# Altium schematic sheet MODULES.SchDoc
size 420 x 297 mm; SheetNumber: 3; SheetTotal: 3
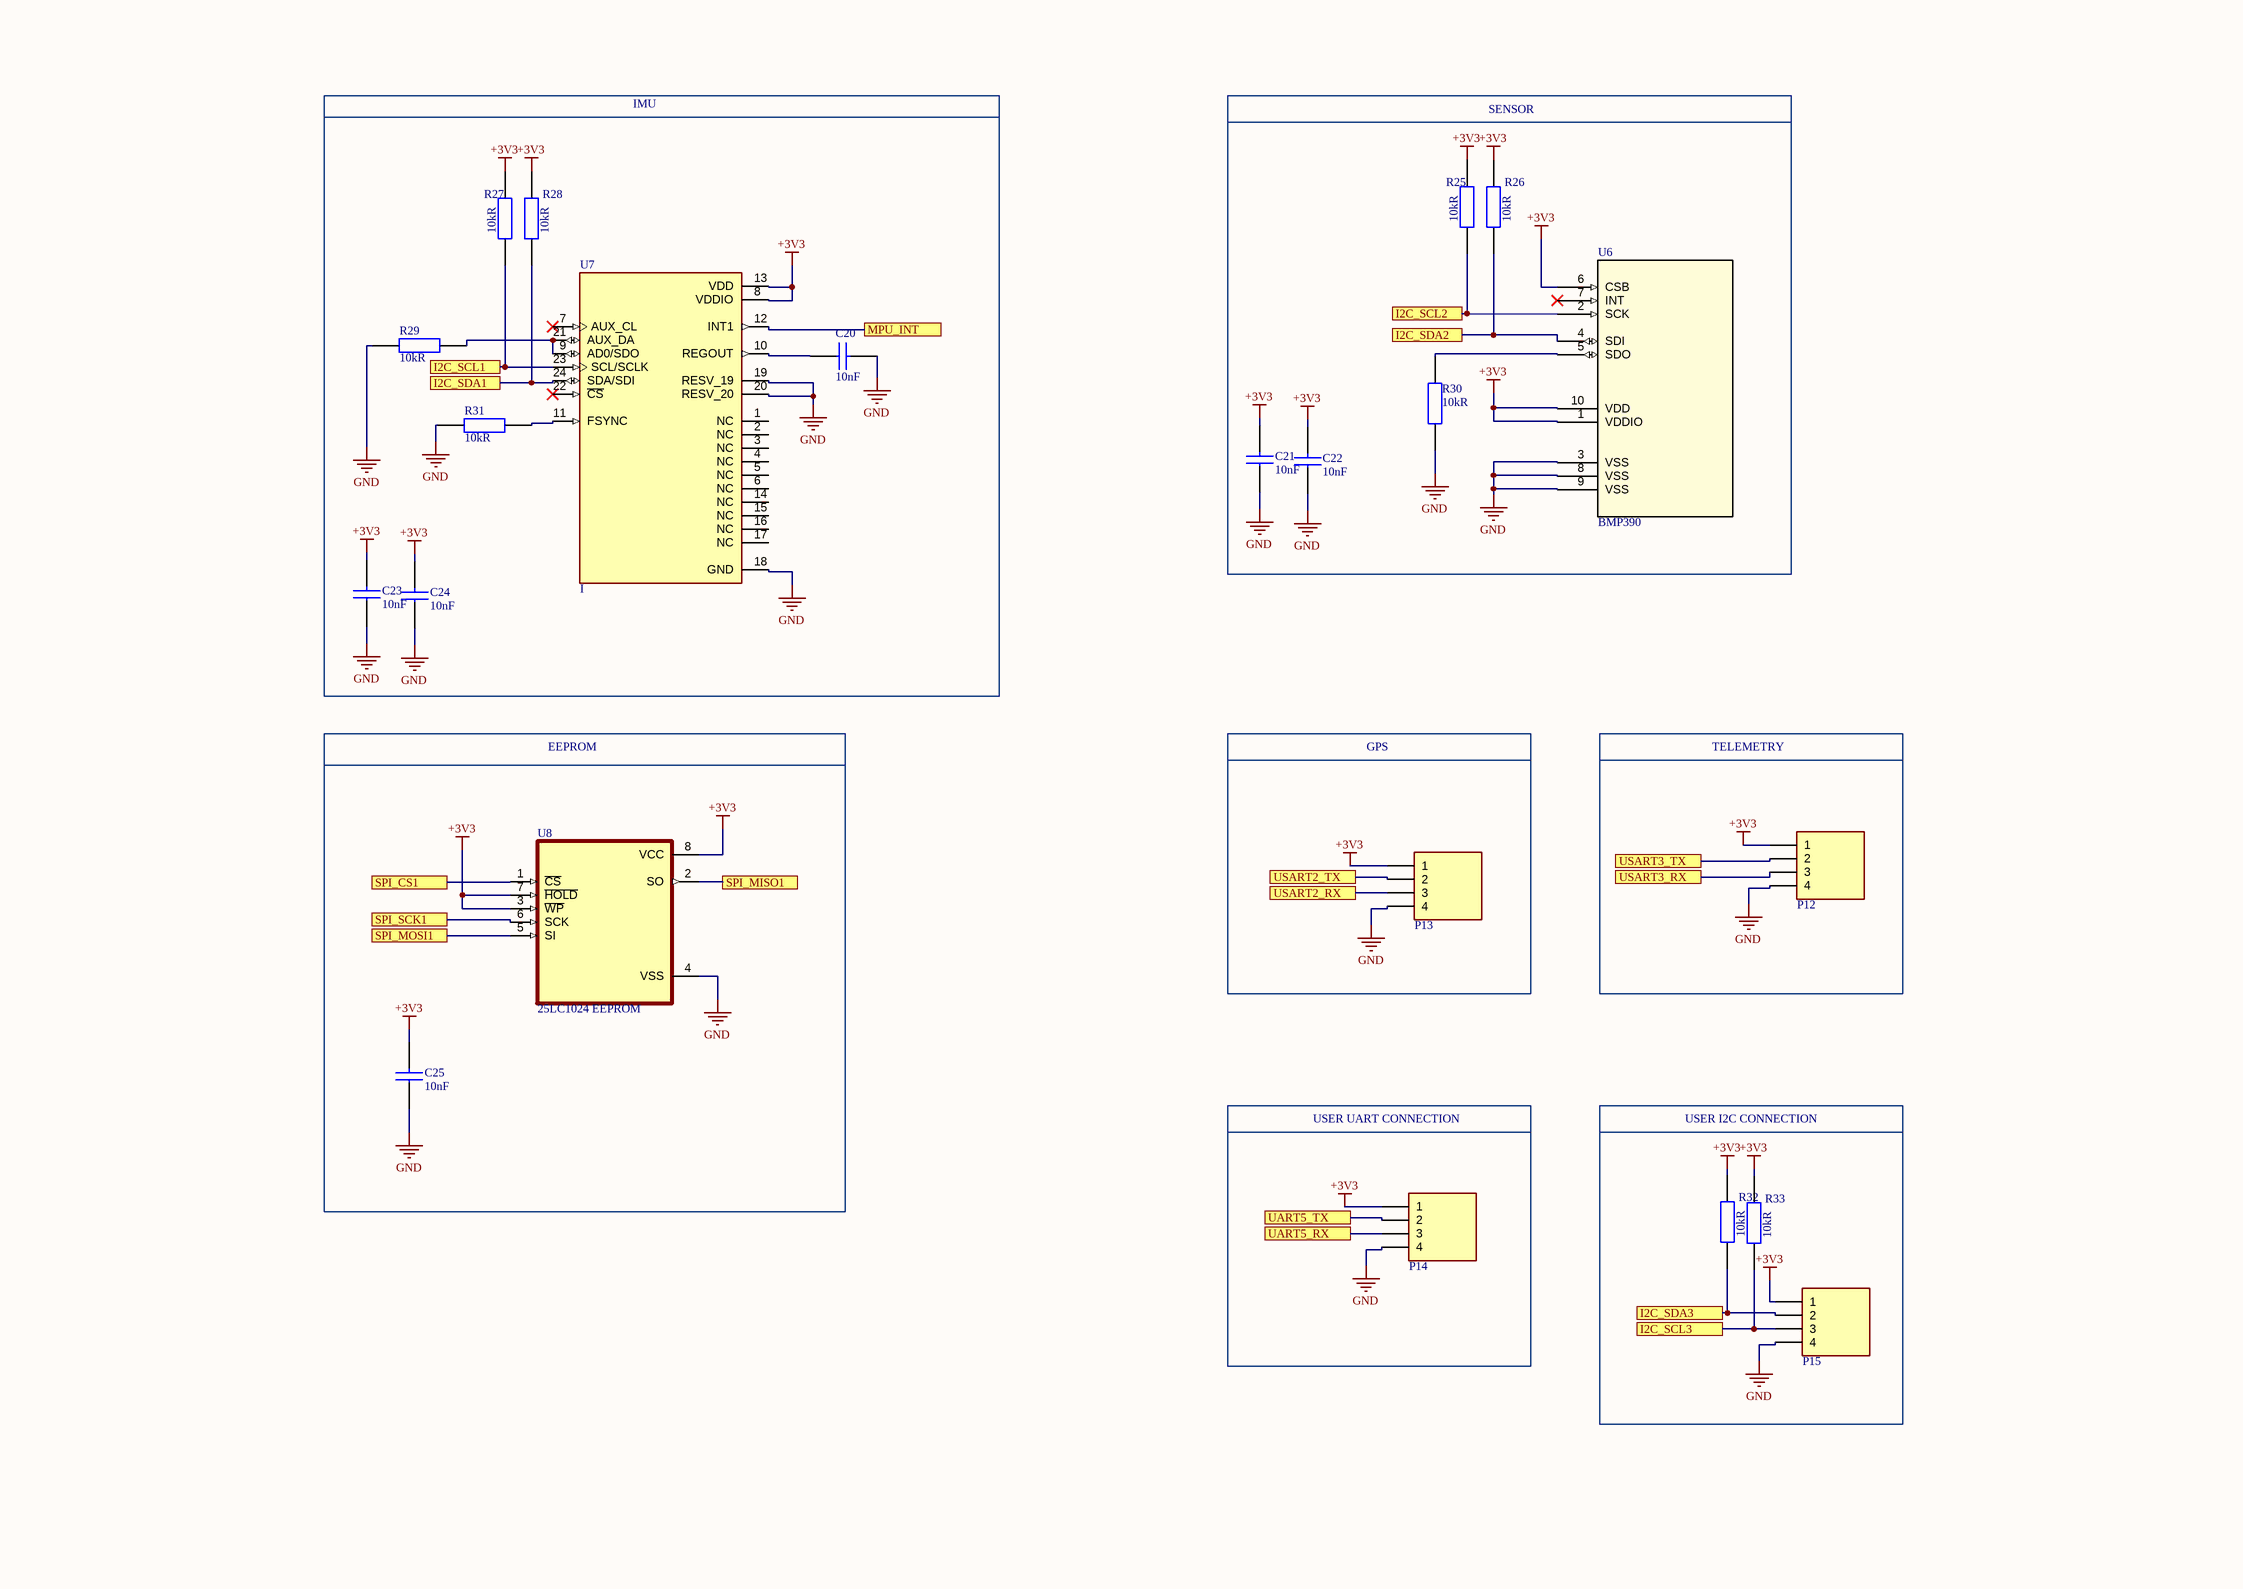
[diagram p0: MODULES.SchDoc]

## Parts
C20  Capacitance: 10nF  [CAP_0603]  (hidden comment: 0603B103K160CT)
C21  Capacitance: 10nF  [CAP_0603]  (hidden comment: 0603B103K160CT)
C22  Capacitance: 10nF  [CAP_0603]  (hidden comment: 0603B103K160CT)
C23  Capacitance: 10nF  [CAP_0603]  (hidden comment: 0603B103K160CT)
C24  Capacitance: 10nF  [CAP_0603]  (hidden comment: 0603B103K160CT)
C25  Capacitance: 10nF  [CAP_0603]  (hidden comment: 0603B103K160CT)
P12  HEADER 4 PIN  [S4B-XH-A]  (value not drawn)
P13  HEADER 4 PIN  [S4B-XH-A]  (value not drawn)
P14  HEADER 4 PIN  [S4B-XH-A]  (value not drawn)
P15  HEADER 4 PIN  [S4B-XH-A]  (value not drawn)
R25  Resistance: 10kR  [RES_0603]  (hidden comment: RC0603FR-0710KL)
R26  Resistance: 10kR  [RES_0603]  (hidden comment: RC0603FR-0710KL)
R27  Resistance: 10kR  [RES_0603]  (hidden comment: RC0603FR-0710KL)
R28  Resistance: 10kR  [RES_0603]  (hidden comment: RC0603FR-0710KL)
R29  Resistance: 10kR  [RES_0603]  (hidden comment: RC0603FR-0710KL)
R30  Resistance: 10kR  [RES_0603]  (hidden comment: RC0603FR-0710KL)
R31  Resistance: 10kR  [RES_0603]  (hidden comment: RC0603FR-0710KL)
R32  Resistance: 10kR  [RES_0603]  (hidden comment: RC0603FR-0710KL)
R33  Resistance: 10kR  [RES_0603]  (hidden comment: RC0603FR-0710KL)
U6  BMP390  [WFLGA-10]
U7  I  [TFQFN-24]
U8  25LC1024 EEPROM  [SOIJ8]

## Blocks framed on the sheet
IMU: C20 C23 C24 R27-R29 R31 U7
SENSOR: C21 C22 R25 R26 R30 U6
EEPROM: C25 U8
GPS: P13
TELEMETRY: P12
USER UART CONNECTION: P14
USER I2C CONNECTION: P15 R32 R33

## Ports
I2C_SCL1 (see MICROCONTROLLER[2B]), I2C_SCL2 (see MICROCONTROLLER[2B]), I2C_SCL3 (see MICROCONTROLLER[2B]), I2C_SDA1 (see MICROCONTROLLER[2B]), I2C_SDA2 (see MICROCONTROLLER[2B]), I2C_SDA3 (see MICROCONTROLLER[4B]), MPU_INT (see MICROCONTROLLER[4A]), SPI_CS1 (see MICROCONTROLLER[2A]), SPI_MISO1 (see MICROCONTROLLER[2B]), SPI_MOSI1 (see MICROCONTROLLER[2B]), SPI_SCK1 (see MICROCONTROLLER[2A]), UART5_RX (see MICROCONTROLLER[4B]), UART5_TX (see MICROCONTROLLER[4B]), USART2_RX (see MICROCONTROLLER[2A]), USART2_TX (see MICROCONTROLLER[2A]), USART3_RX (see MICROCONTROLLER[4B]), USART3_TX (see MICROCONTROLLER[4B])

## Nets
+3V3: C21.2 C22.2 C23.2 C24.2 C25.2 P12.1 P13.1 P14.1 P15.1 R25.2 R26.2 R27.2 R28.2 R32.2 R33.2 U6.1(VDDIO) U6.6(CSB) U6.10(VDD) U7.8(VDDIO) U7.13(VDD) U8.3(~{WP}) U8.7(~{HOLD}) U8.8(VCC)
GND: C20.2 C21.1 C22.1 C23.1 C24.1 C25.1 P12.4 P13.4 P14.4 P15.4 R29.1 R30.1 R31.1 U6.3(VSS) U6.8(VSS) U6.9(VSS) U7.18(GND) U7.19(RESV_19) U7.20(RESV_20) U8.4(VSS)
I2C_SCL1: R27.1 U7.23(SCL/SCLK) ; port I2C_SCL1
I2C_SCL2: R25.1 U6.2(SCK) ; port I2C_SCL2
I2C_SCL3: P15.3 R33.1 ; port I2C_SCL3
I2C_SDA1: R28.1 U7.24(SDA/SDI) ; port I2C_SDA1
I2C_SDA2: R26.1 U6.4(SDI) ; port I2C_SDA2
I2C_SDA3: P15.2 R32.1 ; port I2C_SDA3
MPU_INT: U7.12(INT1) ; port MPU_INT
SPI_CS1: U8.1(~{CS}) ; port SPI_CS1
SPI_MISO1: U8.2(SO) ; port SPI_MISO1
SPI_MOSI1: U8.5(SI) ; port SPI_MOSI1
SPI_SCK1: U8.6(SCK) ; port SPI_SCK1
UART5_RX: P14.3 ; port UART5_RX
UART5_TX: P14.2 ; port UART5_TX
USART2_RX: P13.3 ; port USART2_RX
USART2_TX: P13.2 ; port USART2_TX
USART3_RX: P12.3 ; port USART3_RX
USART3_TX: P12.2 ; port USART3_TX
NetC20_1: C20.1 U7.10(REGOUT)
NetR29_2: R29.2 U7.9(AD0/SDO) U7.21(AUX_DA)
NetR30_2: R30.2 U6.5(SDO)
NetR31_2: R31.2 U7.11(FSYNC)

Not connected (* = marked no-connect by the designer): U6 7(INT)*; U7 1(NC) 2(NC) 3(NC) 4(NC) 5(NC) 6(NC) 7(AUX_CL)* 14(NC) 15(NC) 16(NC) 17(NC) 22(~{CS})*

## Notes on the sheet
- THIS DOCUMENT AND THE DATA DISCLOSED HEREIN OR
- HEREWITH IS THE PROPERTY OF ALTIUM LIMITED AND MAY
- DWG NO:
- REVISION
- REV:
- DESCRIPTION
- DATE
- APPROVED
- BE FREELY DISTRIBUTED IN WHOLE. NO RIGHTS ARE
- RESERVED OR EXPRESS OR IMPLIED WARANTEE GIVEN.
- ENG:
- APPROVALS
- PROJECT
- DSN:
- CHK:
- REFERENCE DOCUMENTS
- PROJECT REVISION:
- TITLE
- DOCUMENT REVISION:
- DESIGN ITEM:
- BOM:
- FAB DWG:
- PCB DWG:
- ASSY DWG:
- SCALE:
- A3
- SIZE
- CAGE CODE
- FILE NAME
- DWG NO.
- SHEET
- OF
- REV

## Library data of the parts
C20-C25 = CAP CER 10nF 0603: CAP CER 10nF %10 0603; Manufacturer: Walsin Technologies; Designed by: BERK; Tolerance: 10%; Dielectric: X7R; Voltage Rating: 16V; Supplier 1: Digi-Key; Manufacturer Part Number: 0603B103K160CT; RoHS: Yes; Category: Ceramic Capacitors; Stock 1: 102474; Pricing 1: 1=0,10000, 10=0,03600, 50=0,01940, 100=0,01590, 500=0,01136, 1000=0,00892 (USD); Case/Package: 0603; Case Code (Metric): 1608; Case Code (Imperial): 0603; Min Operating Temperature: -55°C; Max Operating Temperature: 125°C; Packaging: Tape and Reel; Voltage Rating (DC): 16V; Length: 1.6mm; Depth: 0.8mm; REACH SVHC: Unknown; RoHS Compliant: Yes; ComponentLink1URL: http://www.farnell.com/datasheets/1958513.pdf?src-supplier=Farnell; ComponentLink1Description: http://www.farnell.com/datasheets/1958513.pdf?src-supplier=Farnell; ComponentLink2URL: http://components.arrow.com/part/dataview/0323_00656382?src-supplier=Arrow+Europe; ComponentLink2Description: http://components.arrow.com/part/dataview/0323_00656382?src-supplier=Arrow+Europe; ComponentLink3URL: http://www.farnell.com/datasheets/1958513.pdf?src-supplier=Element14; ComponentLink3Description: http://www.farnell.com/datasheets/1958513.pdf?src-supplier=Element14; ComponentLink4URL: http://www.passivecomponent.com/wp-content/uploads/2018/10/MLCC.pdf?src-supplier=Digi-Key; ComponentLink4Description: http://www.passivecomponent.com/wp-content/uploads/2018/10/MLCC.pdf?src-supplier=Digi-Key; Supplier Part Number 1: 1292-1384-1-ND
P12-P15 = HEADER 4 PIN: Header, Right Angle, 4Way; |Jst / Japan Solderless Terminals S4B-XH-A (LF)(SN); Manufacturer: JST; Connector Type: Male Pin; Contact Resistance: 20mΩ; Current Rating: 3A; Gender: Male; Insulation Resistance: 1GΩ; Max Voltage Rating (AC): 250V; Number of Contacts: 4; Pitch: 2.4892mm; Ratings: TUV; Wire/Cable Gauge: 22AWG; Supplier 1: Farnell; Manufacturer Part Number: S4B-XH-A(LF)(SN); RoHS: Compliant; Category: Headers and Wire Housings; Stock 1: 59807; Pricing 1: 100=0,172, 500=0,149, 1000=0,142, 2500=0,139 (EUR); China RoHS: Compliant; Contact Material: Brass; Contact Plating: Tin; Country of Origin: Japan; Depth: 11.5mm; Export Control Classification Number (ECCN) Code: EAR99; Height: 6.1mm; Housing Color: White; Housing Material: Polyamide; Harmonized Tariff Schedule (HTS) Code: 8536.69.40.40; Insulation Color: White; Introduction Date: 2005-10-20; Lead Free: Lead Free; Lead Pitch: 2.5mm; Length: 12.4mm; Lifecycle Status: Production; Max Current Rating: 3A; Max Operating Temperature: 85°C; Min Operating Temperature: -25°C; Mount: Through Hole; Number of Pins: 4; Number of Poles: 4; Number of Positions: 4; Number of Rows: 1; Orientation: Right Angle; REACH SVHC: No; Terminal Pitch: 2.5mm; Termination: Solder; Voltage Rating: 250V; Voltage Rating (AC): 250V; Weight: 28.349523g; Width: 11.5mm; ComponentLink1URL: https://datasheet.octopart.com:443/S4B-XH-A%28LF%29%28SN%29-JST-datasheet-12510042.pdf?src-supplier=Upverter; ComponentLink1Description: https://datasheet.octopart.com:443/S4B-XH-A%28LF%29%28SN%29-JST-datasheet-12510042.pdf?src-supplier=Upverter; ComponentLink2URL: https://datasheet.octopart.com:443/S4B-XH-A%28LF%29%28SN%29-JST-datasheet-8325564.pdf?src-supplier=Burklin+Elektronik; ComponentLink2Description: https://datasheet.octopart.com:443/S4B-XH-A%28LF%29%28SN%29-JST-datasheet-8325564.pdf?src-supplier=Burklin+Elektronik; ComponentLink3URL: https://datasheet.octopart.com:443/S4B-XH-A%28LF%29%28SN%29-JST-datasheet-138896056.pdf?src-supplier=IHS; ComponentLink3Description: https://datasheet.octopart.com:443/S4B-XH-A%28LF%29%28SN%29-JST-datasheet-138896056.pdf?src-supplier=IHS; ComponentLink4URL: https://datasheet.octopart.com:443/S4B-XH-A-%28LF%29%28SN%29-JST-datasheet-62336360.pdf?src-supplier=element14+APAC; ComponentLink4Description: https://datasheet.octopart.com:443/S4B-XH-A-%28LF%29%28SN%29-JST-datasheet-62336360.pdf?src-supplier=element14+APAC; ComponentLink5URL: https://datasheet.octopart.com:443/S4B-XH-A-%28LF%29%28SN%29-JST-datasheet-63094.pdf?src-supplier=element14+APAC; ComponentLink5Description: https://datasheet.octopart.com:443/S4B-XH-A-%28LF%29%28SN%29-JST-datasheet-63094.pdf?src-supplier=element14+APAC; ComponentLink6URL: https://datasheet.octopart.com:443/S4B-XH-A%28LF%29%28SN%29-JST-datasheet-140264791.pdf?src-supplier=LKR; ComponentLink6Description: https://datasheet.octopart.com:443/S4B-XH-A%28LF%29%28SN%29-JST-datasheet-140264791.pdf?src-supplier=LKR; Supplier Part Number 1: S4B-XH-A (LF)(SN)
R25-R33 = RES 10K OHM 0603: RES 10K %1 OHM 0603 SMD; Manufacturer: Yageo; Designed by: BERK; Tolerance: 1%; Temperature Coefficient: 100ppm/°C; Voltage Rating (DC): 50V; Power Rating: 100mW; Voltage Rating: 75V; Supplier 1: Digi-Key; Manufacturer Part Number: RC0603FR-0710KL; RoHS: Yes; Category: Chip SMD Resistors; Stock 1: 24140601; Pricing 1: 1=0,10000, 10=0,02300, 100=0,00930, 1000=0,00417, 2500=0,00362 (USD); Case/Package: 0603; Number of Pins: 2; Case Code (Imperial): 0603; Case Code (Metric): 1608; Weight: 7.1E-05oz; Size Code: 0603; Min Operating Temperature: -55°C; Max Operating Temperature: 155°C; Resistor Type: Thick Film; Packaging: Tape and Reel; Termination: SMD/SMT; Features: Moisture Resistant; Series: RC; Max Power Dissipation: 100mW; Number of Terminations: 2; Resistance Tolerance: 1%; Construction: Rectangular; Length: 1.6mm; Width: 0.8mm; Height: 0.45mm; Depth: 0.8mm; Lead Pitch: 0.3mm; REACH SVHC: Unknown; Lead Free: Lead Free; Military Standard: Not; RoHS Compliant: Yes; ComponentLink1URL: https://datasheet.ciiva.com/7660/38590-7660789.pdf?src-supplier=Element14; ComponentLink1Description: https://datasheet.ciiva.com/7660/38590-7660789.pdf?src-supplier=Element14; ComponentLink2URL: https://datasheet.ciiva.com/15189/getdatasheetpartid-409289-15189591.pdf?src-supplier=Verical; ComponentLink2Description: https://datasheet.ciiva.com/15189/getdatasheetpartid-409289-15189591.pdf?src-supplier=Verical; ComponentLink3URL: https://datasheet.ciiva.com/46440/1868787-46440891.pdf?src-supplier=Element14; ComponentLink3Description: https://datasheet.ciiva.com/46440/1868787-46440891.pdf?src-supplier=Element14; ComponentLink4URL: https://datasheet.ciiva.com/7983/443971-7983596.pdf?src-supplier=Element14; ComponentLink4Description: https://datasheet.ciiva.com/7983/443971-7983596.pdf?src-supplier=Element14; ComponentLink5URL: https://datasheet.ciiva.com/7746/1738695-7746239.pdf?src-supplier=Element14; ComponentLink5Description: https://datasheet.ciiva.com/7746/1738695-7746239.pdf?src-supplier=Element14; ComponentLink6URL: https://datasheet.ciiva.com/22747/443971-22747519.pdf?src-supplier=Element14; ComponentLink6Description: https://datasheet.ciiva.com/22747/443971-22747519.pdf?src-supplier=Element14; Supplier Part Number 1: 311-10.0KHRCT-ND
U6 = BMP390: 3.0 Shuttle Board Dev Kit BMP390; Manufacturer: Bosch Sensortec; Manufacturer Part Number: SHUTTLE BOARD 3.0 BMP390; Supplier 1: Future Electronics; RoHS: Compliant; Category: Uncategorized; Pricing 1: 2=14,76, 10=14,59, 30=14,48, 125=14,33, 300=14,12 (USD); ComponentLink1URL: https://datasheet.octopart.com:443/SHUTTLE-BOARD-3.0-BMP390-Bosch-Sensortec-datasheet-179288316.pdf?src-supplier=Future+Electronics; ComponentLink1Description: https://datasheet.octopart.com:443/SHUTTLE-BOARD-3.0-BMP390-Bosch-Sensortec-datasheet-179288316.pdf?src-supplier=Future+Electronics; Supplier Part Number 1: SHUTTLE BOARD 3.0 BMP390
U7 = ICM-20948: IMU (Inertial Measurement Unit), 9-Axis, Accelerometer, Gyroscope, Compass; Manufacturer: TDK; Manufacturer Lifecycle Status: PRODUCTION (NOT RECOMMENDED FOR NEW DESIGN); Max Supply Voltage: 3.6V; Min Supply Voltage: 1.71V; Nominal Supply Voltage (DC): 1.8V; Number of Circuits: 1; Supplier 1: Farnell; Manufacturer Part Number: ICM-20948; RoHS: Compliant; Category: Inertial Measurement Units (IMUs); Pricing 1: 1=4,14 (EUR); Ambient Temperature Range High: 85°C; Height: 980µm; Height - Seated (Max): 1.05mm; Introduction Date: 2017-06-02; Length: 3mm; Lifecycle Status: NRND; LTB Date: 2026-04-15; LTD Date: 2026-10-30; Max Length: 3.1mm; Max Operating Temperature: 85°C; Max Thickness: 1.05mm; Max Width: 3.1mm; Min Length: 2.9mm; Min Operating Temperature: -40°C; Min Thickness: 950µm; Min Width: 2.9mm; Mount: Surface Mount; Number of Terminals: 24; REACH SVHC: Yes; Temperature Grade: Industrial; Terminal Pitch: 400µm; Width: 3mm; ComponentLink1URL: https://datasheet.octopart.com:443/ICM-20948-InvenSense-datasheet-165301323.pdf?src-supplier=TDK; ComponentLink1Description: https://datasheet.octopart.com:443/ICM-20948-InvenSense-datasheet-165301323.pdf?src-supplier=TDK; ComponentLink2URL: https://datasheet.octopart.com:443/ICM-20948-InvenSense-datasheet-155375717.pdf?src-supplier=TDK; ComponentLink2Description: https://datasheet.octopart.com:443/ICM-20948-InvenSense-datasheet-155375717.pdf?src-supplier=TDK; ComponentLink3URL: https://datasheet.octopart.com:443/ICM-20948-InvenSense-datasheet-115290367.pdf?src-supplier=Ciiva; ComponentLink3Description: https://datasheet.octopart.com:443/ICM-20948-InvenSense-datasheet-115290367.pdf?src-supplier=Ciiva; ComponentLink4URL: https://datasheet.octopart.com:443/ICM-20948-TDK-datasheet-181267871.pdf?src-supplier=IHS; ComponentLink4Description: https://datasheet.octopart.com:443/ICM-20948-TDK-datasheet-181267871.pdf?src-supplier=IHS; ComponentLink5URL: https://datasheet.octopart.com:443/ICM-20948-InvenSense-datasheet-81456500.pdf?src-supplier=Component+Distributors+Inc.; ComponentLink5Description: https://datasheet.octopart.com:443/ICM-20948-InvenSense-datasheet-81456500.pdf?src-supplier=Component+Distributors+Inc.; ComponentLink6URL: https://datasheet.octopart.com:443/ICM-20948-InvenSense-datasheet-79613978.pdf?src-supplier=Component+Distributors+Inc.; ComponentLink6Description: https://datasheet.octopart.com:443/ICM-20948-InvenSense-datasheet-79613978.pdf?src-supplier=Component+Distributors+Inc.; ComponentLink7URL: https://datasheet.octopart.com:443/ICM-20948-InvenSense-datasheet-62330990.pdf?src-supplier=Component+Distributors+Inc.; ComponentLink7Description: https://datasheet.octopart.com:443/ICM-20948-InvenSense-datasheet-62330990.pdf?src-supplier=Component+Distributors+Inc.; Supplier Part Number 1: ICM-20948
U8 = 25LC1024 EEPROM: SPI Serial EEPROM Family, 8-bit, 20 MHz, 2.5 to 5.5V, -40°Cto 125°C, SOIJ-8, RoHS; Manufacturer: Microchip; Manufacturer Part Number: 25LC1024-E/SM; Manufacturer Lifecycle Status: REL; Density: 1Mb; Frequency: 20MHz; Interface: SPI, Serial; Min Supply Voltage: 2.5V; Nominal Supply Current: 10mA; Number of Words: 128000; Supplier 1: Farnell; RoHS: Compliant; Category: EEPROM; Stock 1: 4330; Pricing 1: 1=7,43, 25=6,5, 100=5,39, 250=4,83 (EUR); Projected EOL Date: 2034-05-15; Case/Package: SOIC; Contact Plating: Tin; Country of Assembly: Thailand; Country of Fabrication: United States of America; Country of Origin: Thailand; Export Control Classification Number (ECCN) Code: 3A991.b.1.b.2; Height: 1.98mm; HS Code: 8542.32.0051; Harmonized Tariff Schedule (HTS) Code: 8542.32.0051; Introduction Date: 2007-05-15; Lead Free: Lead Free; Length: 5.26mm; Lifecycle Status: Production; Max Frequency: 20MHz; Max Operating Temperature: 125°C; Max Supply Voltage: 5.5V; Memory Type: EEPROM; Min Operating Temperature: -40°C; Mount: Surface Mount; Number of Pins: 8; Packaging: Rail/Tube; Radiation Hardening: No; REACH SVHC: No; Schedule B: 8542320050, 8542320050|8542320050|8542320050|8542320050|8542320050; Width: 5.25mm; ComponentLink1URL: https://datasheet.octopart.com:443/25LC1024-E-SM-Microchip-datasheet-159614136.pdf?src-supplier=Microchip; ComponentLink1Description: https://datasheet.octopart.com:443/25LC1024-E-SM-Microchip-datasheet-159614136.pdf?src-supplier=Microchip; ComponentLink2URL: https://datasheet.octopart.com:443/25LC1024-E/SM-Microchip-datasheet-8835771.pdf?src-supplier=Farnell; ComponentLink2Description: https://datasheet.octopart.com:443/25LC1024-E/SM-Microchip-datasheet-8835771.pdf?src-supplier=Farnell; ComponentLink3URL: https://datasheet.octopart.com:443/25LC1024-E/SM-Microchip-datasheet-14358349.pdf?src-supplier=Farnell; ComponentLink3Description: https://datasheet.octopart.com:443/25LC1024-E/SM-Microchip-datasheet-14358349.pdf?src-supplier=Farnell; ComponentLink4URL: https://datasheet.octopart.com:443/25LC1024-E/SM-Microchip-datasheet-14153211.pdf?src-supplier=iiiC; ComponentLink4Description: https://datasheet.octopart.com:443/25LC1024-E/SM-Microchip-datasheet-14153211.pdf?src-supplier=iiiC; ComponentLink5URL: https://datasheet.octopart.com:443/25LC1024-E/SM-Microchip-datasheet-11406.pdf?src-supplier=Mouser; ComponentLink5Description: https://datasheet.octopart.com:443/25LC1024-E/SM-Microchip-datasheet-11406.pdf?src-supplier=Mouser; ComponentLink6URL: http://sigma.octopart.com:80/188449428/materials_sheet/Microchip-25LC1024-E-SM.pdf?src-supplier=Compliance+Statements; ComponentLink6Description: http://sigma.octopart.com:80/188449428/materials_sheet/Microchip-25LC1024-E-SM.pdf?src-supplier=Compliance+Statements; ComponentLink7URL: http://sigma.octopart.com:80/193394468/materials_sheet/Microchip-25LC1024-E-SM.pdf?src-supplier=Compliance+Statements; ComponentLink7Description: http://sigma.octopart.com:80/193394468/materials_sheet/Microchip-25LC1024-E-SM.pdf?src-supplier=Compliance+Statements; ComponentLink8URL: http://sigma.octopart.com:80/rohs_statement/Microchip-company-71.pdf?src-supplier=Compliance+Statements; ComponentLink8Description: http://sigma.octopart.com:80/rohs_statement/Microchip-company-71.pdf?src-supplier=Compliance+Statements; ComponentLink9URL: http://sigma.octopart.com:80/reach_statement/Microchip-company-70.pdf?src-supplier=Compliance+Statements; ComponentLink9Description: http://sigma.octopart.com:80/reach_statement/Microchip-company-70.pdf?src-supplier=Compliance+Statements; ComponentLink10URL: http://sigma.octopart.com:80/conflict_mineral_statement/Microchip-company-69.pdf?src-supplier=Compliance+Statements; ComponentLink10Description: http://sigma.octopart.com:80/conflict_mineral_statement/Microchip-company-69.pdf?src-supplier=Compliance+Statements; ComponentLink11URL: http://sigma.octopart.com:80/conflict_mineral_statement/Microchip-company-68.pdf?src-supplier=Compliance+Statements; ComponentLink11Description: http://sigma.octopart.com:80/conflict_mineral_statement/Microchip-company-68.pdf?src-supplier=Compliance+Statements; Supplier Part Number 1: 25LC1024-E/SM